# EasyEDA Pro project ProProject_STM32F407IGT6_2024-02-27.epro, board PCB2
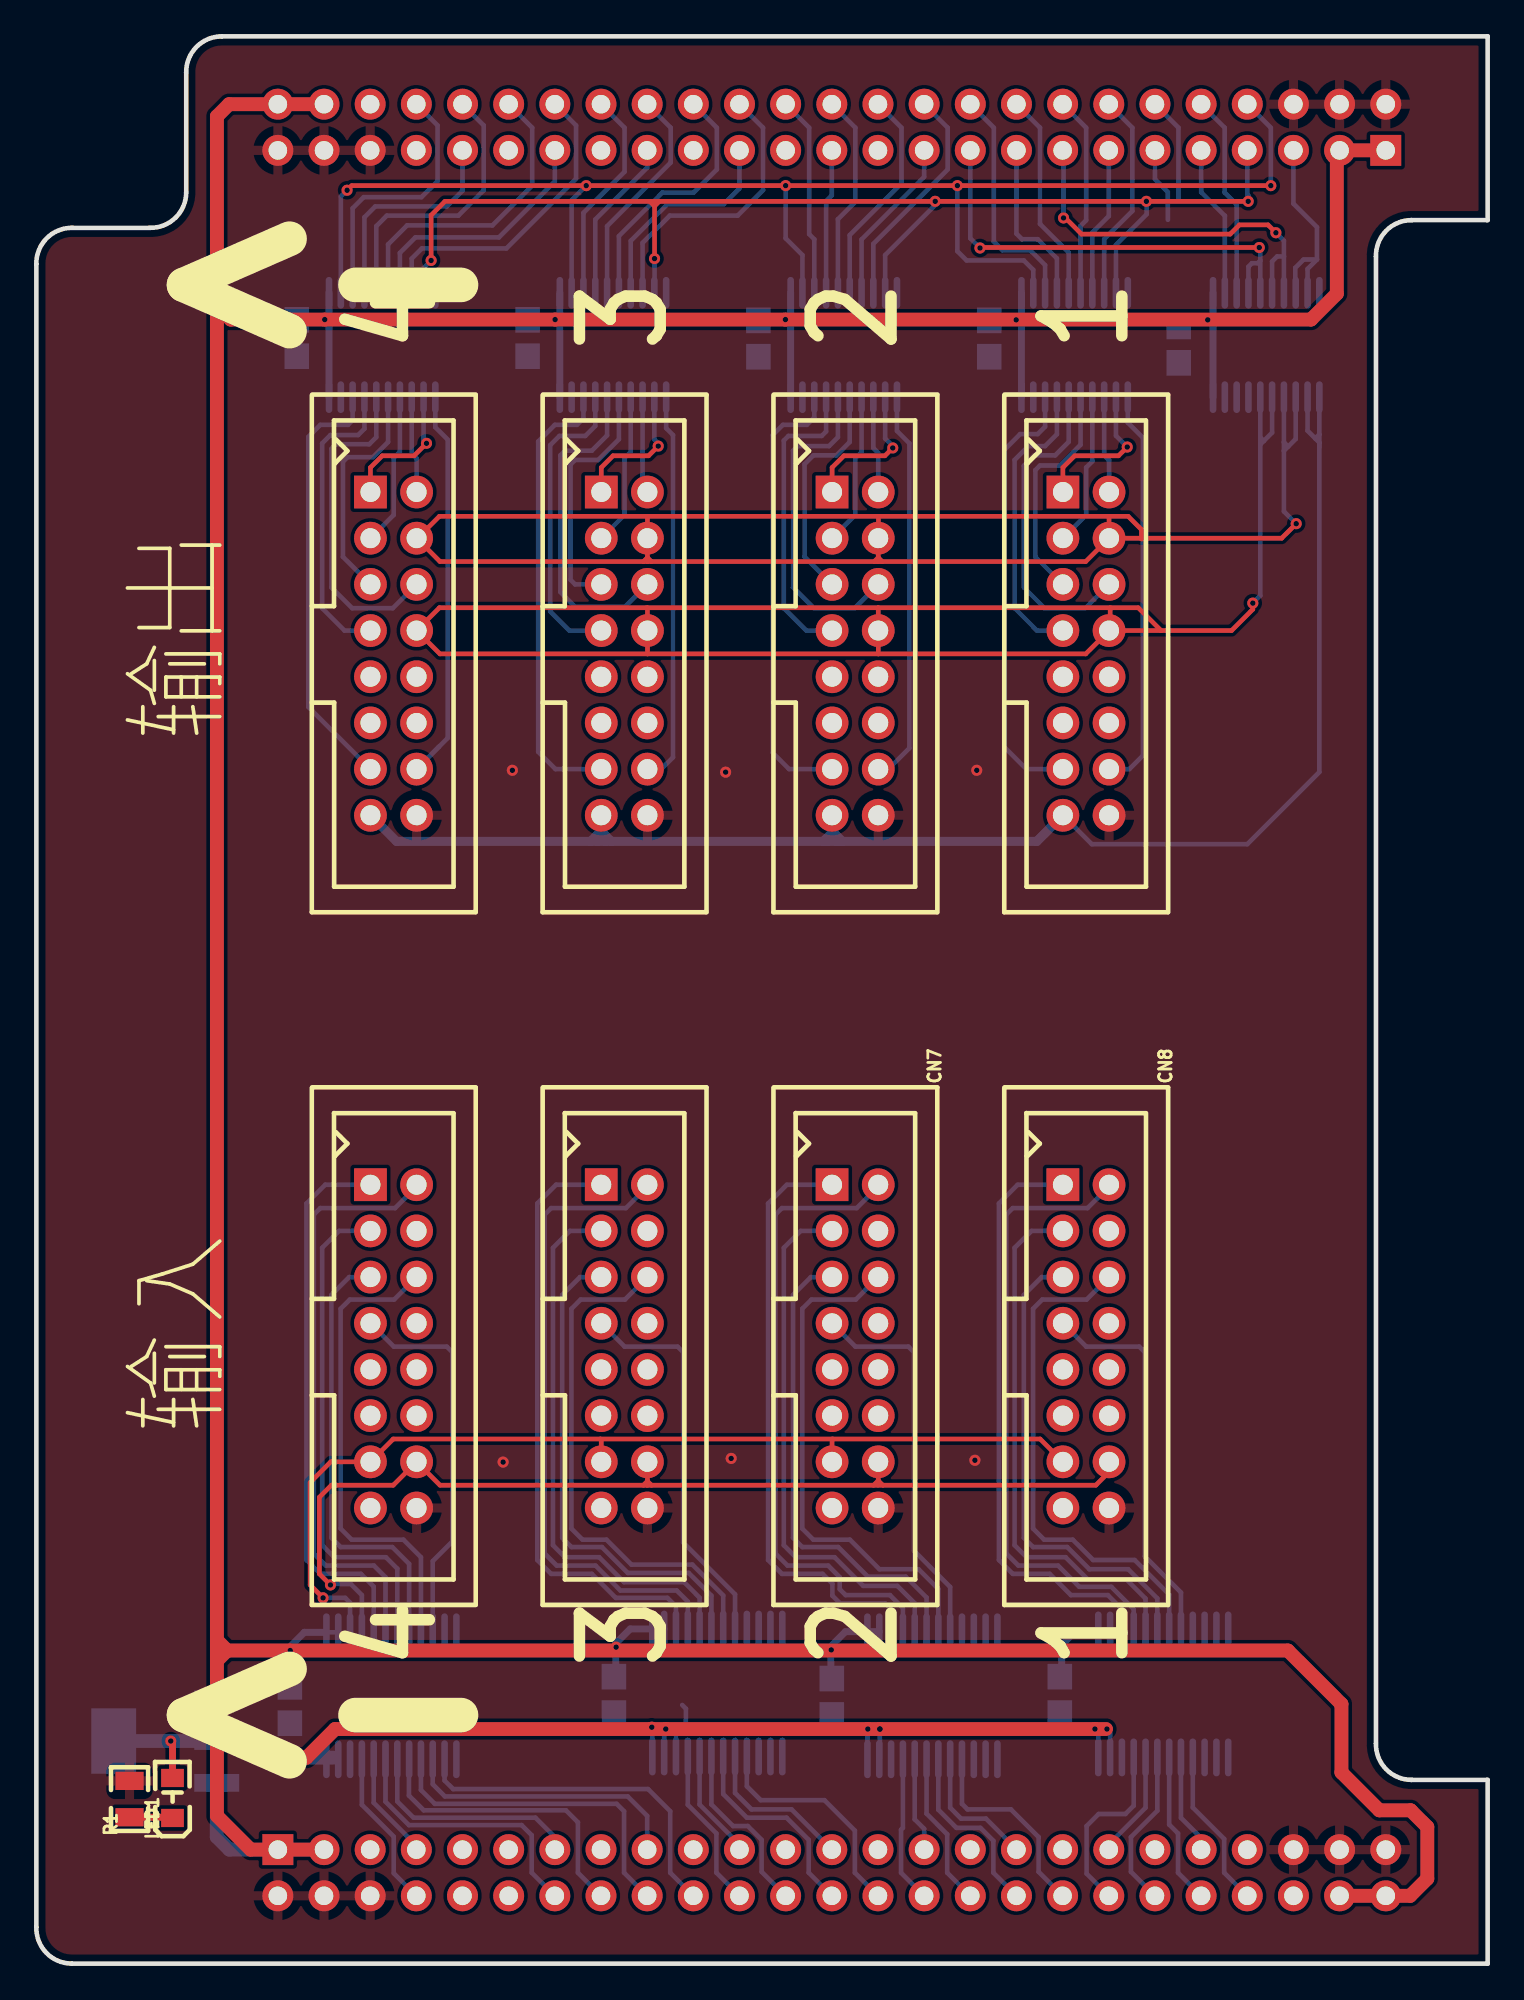
[diagram p6: board, top side]
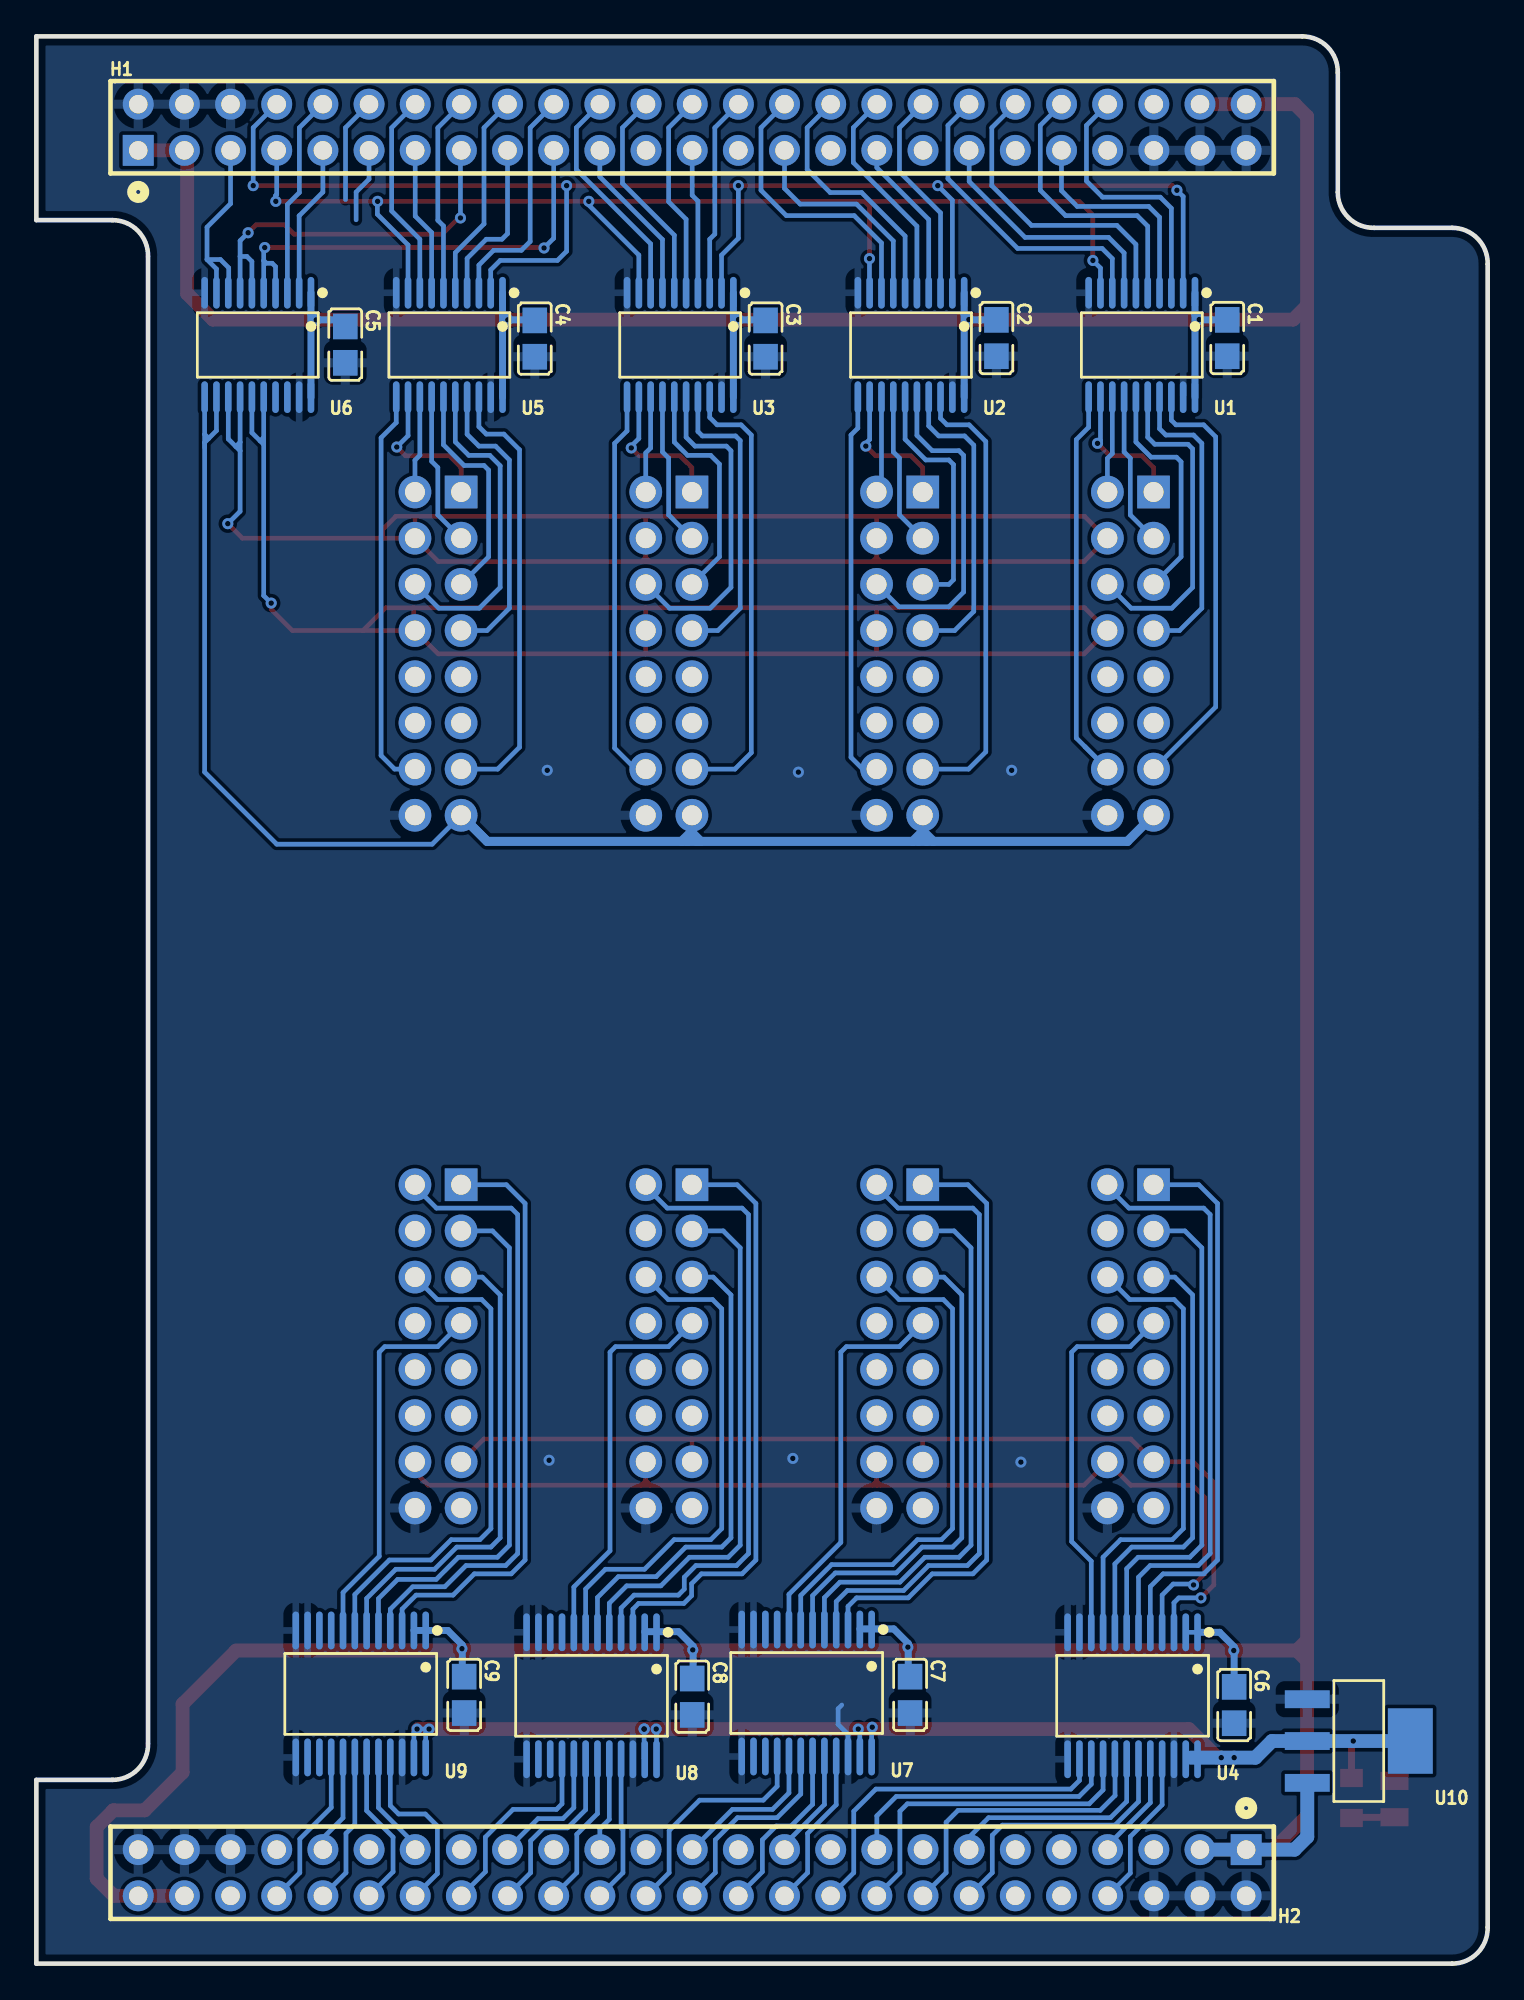
[diagram p7: board, bottom side, seen from below]

Outline 79.85 x 106 mm; copper layers: Top Layer, Bottom Layer. Coordinates in mm from the lower left corner of the outline.
Outline path: 0,93.47 0,2 arc(0.56,0.59) 1.95,0 79.85,0 79.85,10.11 75.66,10.11 arc(74.26,10.7) 73.71,12.11 73.71,93.89 arc(74.27,95.3) 75.66,95.89 79.85,95.89 79.85,106 10.2,106 arc(8.8,105.41) 8.25,104 8.25,97.42 arc(7.66,96.03) 6.25,95.47 1.95,95.47 arc(0.56,94.88) 0,93.47
Stack: Top Layer 0.035mm / Dielectric1 1.51mm FR4 er 4.5 / Bottom Layer 0.035mm

## Design rules (mm)
template: JLCPCB Capability(Two Layers Board)
spacing copperThickness1oz (default): track to track 0.102, other pairs 0.152 to 0.3
spacing copperThickness2oz: track to track 0.203, other pairs 0.152 to 0.3
track width copperThickness1oz (default): min 0.127, default 0.254, max 2.54
track width copperThickness2oz: min 0.203, default 0.254, max 2.54
differential pair differentialPair (default): width min 0.127, default 0.254, max 2.54; gap min 0.152, default 0.152
via viaSize (default): diameter min 0.5, default 0.61, max 10; hole min 0.3, default 0.305, max 6.3

## Placement (name value [footprint] x y rotation side)
C1  100nF  [C0805]  14.33 89.41 270 bottom
C2  100nF  [C0805]  27.03 89.41 270 bottom
C3  100nF  [C0805]  39.73 89.38 270 bottom
C4  100nF  [C0805]  52.43 89.38 270 bottom
C5  100nF  [C0805]  62.86 89.05 270 bottom
C6  100nF  [C0805]  13.95 14.22 270 bottom
C7  100nF  [C0805]  31.78 14.78 270 bottom
C8  100nF  [C0805]  43.77 14.68 270 bottom
C9  100nF  [C0805]  56.32 14.78 270 bottom
CN1  BH254V-16P  [IDC-TH_16P-P2.54-V-R2-C8-S2.54]  57.75 72.05 270 top
CN2  BH254V-16P  [IDC-TH_16P-P2.54-V-R2-C8-S2.54]  45.05 72.05 270 top
CN3  BH254V-16P  [IDC-TH_16P-P2.54-V-R2-C8-S2.54]  32.35 72.05 270 top
CN4  BH254V-16P  [IDC-TH_16P-P2.54-V-R2-C8-S2.54]  19.65 72.05 270 top
CN5  BH254V-16P  [IDC-TH_16P-P2.54-V-R2-C8-S2.54]  19.65 33.95 270 top
CN6  BH254V-16P  [IDC-TH_16P-P2.54-V-R2-C8-S2.54]  32.35 33.95 270 top
CN7  BH254V-16P  [IDC-TH_16P-P2.54-V-R2-C8-S2.54]  45.05 33.95 270 top
CN8  BH254V-16P  [IDC-TH_16P-P2.54-V-R2-C8-S2.54]  57.75 33.95 270 top
H1  FH-00077  [HDR-TH_50P-P2.54-V-F-R2-C25-S2.54-1]  43.77 101 180 bottom
H2  FH-00077  [HDR-TH_50P-P2.54-V-F-R2-C25-S2.54-1]  43.77 5 0 bottom
LED1  -  [LED0805-RD_RED]  7.49 9.11 90 top
R1  1K  [R0805]  5.13 9.05 90 top
U1  SN74HC245PW  [TSSOP-20_L6.5-W4.4-P0.65-LS6.4-BL]  19.03 89.03 0 bottom
U2  SN74HC245PW  [TSSOP-20_L6.5-W4.4-P0.65-LS6.4-BL]  31.73 89.03 0 bottom
U3  SN74HC245PW  [TSSOP-20_L6.5-W4.4-P0.65-LS6.4-BL]  44.43 89.03 0 bottom
U4  SN74LVC4245ADBR  [SSOP-24_L8.4-W5.8-P0.65-LS7.8-BL]  19.54 14.73 0 bottom
U5  SN74HC245PW  [TSSOP-20_L6.5-W4.4-P0.65-LS6.4-BL]  57.13 89.03 0 bottom
U6  SN74HC245PW  [TSSOP-20_L6.5-W4.4-P0.65-LS6.4-BL]  67.67 89.03 0 bottom
U7  SN74LVC4245ADBR  [SSOP-24_L8.4-W5.8-P0.65-LS7.8-BL]  37.47 14.88 0 bottom
U8  SN74LVC4245ADBR  [SSOP-24_L8.4-W5.8-P0.65-LS7.8-BL]  49.31 14.73 0 bottom
U9  SN74LVC4245ADBR  [SSOP-24_L8.4-W5.8-P0.65-LS7.8-BL]  62.01 14.83 0 bottom
U10  AMS1117-3.3  [SOT-223-4_L6.5-W3.5-P2.30-LS7.0-BR]  7.09 12.24 0 bottom

## Footprints (pads in the part's own frame, mm; a bottom-side part is the same pattern mirrored in y, then rotated)
C0805
  rect 1.41x1.35 smd: 1(-1,0) 2(1,0)
HDR-TH_50P-P2.54-V-F-R2-C25-S2.54-1
  rect 1.7x1.7 hole 1.02: 1(-30.48,-1.27)
  round 1.7 hole 1.02: 2(-30.48,1.27) 3(-27.94,-1.27) 4(-27.94,1.27) 5(-25.4,-1.27) 6(-25.4,1.27) 7(-22.86,-1.27) 8(-22.86,1.27) 9(-20.32,-1.27) 10(-20.32,1.27) 11(-17.78,-1.27) 12(-17.78,1.27) 13(-15.24,-1.27) 14(-15.24,1.27) 15(-12.7,-1.27) 16(-12.7,1.27) 17(-10.16,-1.27) 18(-10.16,1.27) 19(-7.62,-1.27) 20(-7.62,1.27) 21(-5.08,-1.27) 22(-5.08,1.27) 23(-2.54,-1.27) 24(-2.54,1.27) 25(0,-1.27) 26(0,1.27) 27(2.54,-1.27) 28(2.54,1.27) 29(5.08,-1.27) 30(5.08,1.27) 31(7.62,-1.27) 32(7.62,1.27) 33(10.16,-1.27) 34(10.16,1.27) 35(12.7,-1.27) 36(12.7,1.27) 37(15.24,-1.27) 38(15.24,1.27) 39(17.78,-1.27) 40(17.78,1.27) 41(20.32,-1.27) 42(20.32,1.27) 43(22.86,-1.27) 44(22.86,1.27) 45(25.4,-1.27) 46(25.4,1.27) 47(27.94,-1.27) 48(27.94,1.27) 49(30.48,-1.27) 50(30.48,1.27)
IDC-TH_16P-P2.54-V-R2-C8-S2.54
  rect 1.8x1.8 hole 1.1: 1(-8.89,-1.27)
  round 1.8 hole 1.1: 2(-8.89,1.27) 3(-6.35,-1.27) 4(-6.35,1.27) 5(-3.81,-1.27) 6(-3.81,1.27) 7(-1.27,-1.27) 8(-1.27,1.27) 9(1.27,-1.27) 10(1.27,1.27) 11(3.81,-1.27) 12(3.81,1.27) 13(6.35,-1.27) 14(6.35,1.27) 15(8.89,-1.27) 16(8.89,1.27)
LED0805-RD_RED
  rect 1x1.25 smd: 1(-1.1,0) 2(1.1,0)
R0805
  rect 1x1.55 smd: 1(-1,0) 2(1,0)
SOT-223-4_L6.5-W3.5-P2.30-LS7.0-BR
  rect 2.47x0.98 smd: 1(2.835,-2.3) 2(2.835,0) 3(2.835,2.3)
  rect 2.47x3.6 smd: 4(-2.835,0)
SSOP-24_L8.4-W5.8-P0.65-LS7.8-BL
  oval 0.364x2.082 smd: 1(-3.575,-3.491) 2(-2.925,-3.491) 3(-2.275,-3.491) 4(-1.625,-3.491) 5(-0.975,-3.491) 6(-0.325,-3.491) 7(0.325,-3.491) 8(0.975,-3.491) 9(1.625,-3.491) 10(2.275,-3.491) 11(2.925,-3.491) 12(3.575,-3.491) 13(3.575,3.491) 14(2.925,3.491) 15(2.275,3.491) 16(1.625,3.491) 17(0.975,3.491) 18(0.325,3.491) 19(-0.325,3.491) 20(-0.975,3.491) 21(-1.625,3.491) 22(-2.275,3.491) 23(-2.925,3.491) 24(-3.575,3.491)
TSSOP-20_L6.5-W4.4-P0.65-LS6.4-BL
  oval 0.364x1.742 smd: 1(-2.925,-2.871) 2(-2.275,-2.871) 3(-1.625,-2.871) 4(-0.975,-2.871) 5(-0.325,-2.871) 6(0.325,-2.871) 7(0.975,-2.871) 8(1.625,-2.871) 9(2.275,-2.871) 10(2.925,-2.871) 11(2.925,2.871) 12(2.275,2.871) 13(1.625,2.871) 14(0.975,2.871) 15(0.325,2.871) 16(-0.325,2.871) 17(-0.975,2.871) 18(-1.625,2.871) 19(-2.275,2.871) 20(-2.925,2.871)

## Nets
As in the schematic.

Pads without a net: CN1 9 10 11 12; CN2 9 10 11 12; CN3 9 10 11 12; CN4 9 10 11 12; CN5 4 8 9 10 11 12; CN6 4 8 9 10 11 12; CN7 4 8 9 10 11 12; CN8 4 8 9 10 11 12; H1 9 10 11 12; H2 9 10 11 12; U6 2 3 17 18

## Via types
v1: diameter 0.61, hole 0.305, Top Layer to Bottom Layer, 47 vias

## Routing (per net, layer and track width the routed paths; a pad name or vN(x,y) marks a point on that pad's centre or on a via; arc(x,y) is an arc through that point)
+3.3V: length 70.7
  Top Layer w0.254: 33.85,12.9 33.85,13 v1(33.86,13) ; v1(14.66,11.33) 14.66,11.38
  Top Layer w0.381: v1(7.4,12.24) 7.49,12.15 LED1.2
  Top Layer w0.762: v1(13.95,11.33) v1(14.66,11.33) 14.86,11.33 16.44,12.9 v1(34.63,12.9) v1(45.75,12.9) v1(46.41,12.9) v1(58.25,12.9) 58.86,12.9
  Bottom Layer w0.254: U7.24 33.89,12.97 v1(33.86,13) ; U9.23 59.08,12.73 v1(58.91,12.9) v1(58.25,12.9) 58.43,12.72 U9.24 ; v1(45.75,12.9) 45.73,12.88 U8.24 ; U7.23 34.54,12.82 v1(34.63,12.9) ; U8.23 46.41,11.27 v1(46.41,12.9)
  Bottom Layer w0.762: U10.4 v1(7.4,12.24) 11.87,12.24 12.78,11.33 v1(13.95,11.33) v1(14.66,11.33) 16.34,11.33
+5V: length 329.6
  Top Layer w0.762: H1.1 71.82,99.73 71.56,99.47 ; 9.94,17.79 9.94,16.66 ; 9.94,17.79 9.94,91.19 ; 9.94,17.79 10.5,17.22 ; 9.94,16.66 10.5,17.22 ; 9.94,16.66 9.94,8.13 11.79,6.27 H2.1 H2.3 ; 9.94,91.19 9.94,101.6 10.61,102.27 H1.50 H1.48 ; 9.94,91.19 10.7,90.42 v1(15.87,90.42) v1(28.54,90.42) v1(41.22,90.42) 70.13,90.42 71.56,91.85 71.56,99.47 ; 71.56,99.47 71.56,99.58 H1.3 ; 10.5,17.22 v1(13.97,17.22) 68.86,17.22 71.81,14.28 71.81,10.52 73.89,8.43 75.62,8.43 76.53,7.52 76.53,4.67 75.59,3.73 H2.50 H2.48
  Bottom Layer w0.254: 15.96,18.22 U4.2
  Bottom Layer w0.381: 64.74,90.7 U6.1 ; 64.74,90.7 U6.20 ; 64.74,90.7 v1(64.45,90.41) 62.97,90.41 ; 43.72,15.26 43.72,17.46 44.52,18.26 46.38,18.26 ; 54.2,90.7 U5.20 ; 54.2,90.7 U5.1 ; 54.2,90.7 v1(53.91,90.41) 52.43,90.41 ; 39.73,90.41 41.21,90.41 41.5,90.7 ; 41.5,90.7 U3.20 ; 41.5,90.7 U3.1 ; 34.54,18.41 32.68,18.41 31.88,17.61 31.88,15.41 ; U9.2 U9.1 57.22,18.32 56.42,17.53 56.42,15.33 ; C1.1 15.81,90.41 16.1,90.7 ; C2.1 28.51,90.41 28.8,90.7 ; 28.8,90.7 U2.20 ; 28.8,90.7 U2.1 ; 16.1,90.7 U1.1 ; 16.1,90.7 U1.20 ; C6.1 13.95,17.42 14.75,18.22 15.96,18.22
  Bottom Layer w0.762: 9.93,9.94 9.93,6.97 10.62,6.27 H2.1 H2.3
  vias: v1(31.9,17.41) v1(43.74,17.25) v1(56.44,17.32)
GND: length 3.1
  Bottom Layer w0.254: U7.22 35.19,12.61 35.74,13.16 35.74,14.02 35.54,14.22
  vias: v1(25.68,27.58) v1(26.19,65.63) v1(37.93,65.53) v1(38.23,27.79) v1(51.64,27.69) v1(51.74,65.63)
(no net): length 29.5
  Bottom Layer w0.254: U6.3 66.04,96.75 65.38,97.41 65.38,100.97 H1.10 ; H1.11 61.55,98.15 62.26,97.43 62.26,95.91 ; 65.39,96.13 64.09,97.43 H1.9 ; 65.39,96.13 65.39,96.14 ; 65.39,96.13 U6.2 ; H1.12 62.84,100.97 62.84,97.03
BD0: length 11
  Bottom Layer w0.254: H1.16 57.76,100.97 57.76,95.89 57.45,95.58 57.45,91.9
BD1: length 13
  Bottom Layer w0.254: U5.3 55.5,93.42 54.69,94.23 53.17,94.23 52.68,94.72 52.68,100.97 H1.20
BD2: length 12.1
  Bottom Layer w0.254: H1.24 47.6,100.97 47.6,97.92 44.75,95.07 U3.6
BD3: length 11
  Bottom Layer w0.254: U3.3 42.8,94.84 42.52,95.12 42.52,100.97 H1.28
BD4: length 14.2
  Bottom Layer w0.254: 32.05,91.9 32.05,95.02 34.45,97.41 36.17,97.41 37.44,98.68 37.44,100.97 H1.32
BD5: length 11.8
  Bottom Layer w0.254: U2.3 30.1,96.29 32.36,98.55 32.36,100.97 H1.36
BD6: length 16.9
  Bottom Layer w0.254: U1.6 19.35,94.56 20.4,95.61 25.1,95.61 27.28,97.79 27.28,100.97 H1.40
BD7: length 14.7
  Bottom Layer w0.254: H1.44 22.08,101.1 22.08,98.04 21.19,97.16 18.01,97.16 17.4,96.55 U1.3
BD8: length 16.5
  Bottom Layer w0.254: H2.16 29.8,5 29.8,7.77 29.14,8.43 21.31,8.43 20.5,9.25 20.5,11.23 U4.17
BD9: length 19.5
  Bottom Layer w0.254: U4.14 22.46,10.07 22.93,9.6 33.66,9.6 34.88,8.38 34.88,5 H2.20
BD10: length 9.8
  Bottom Layer w0.254: U7.19 37.14,8.76 38.33,7.57 39.15,7.57 39.91,6.81 39.91,5.05 H2.24
BD11: length 12.7
  Bottom Layer w0.254: U7.16 39.09,9.75 39.86,8.99 43.36,8.99 45.04,7.31 45.04,5 H2.28
BD12: length 8.5
  Bottom Layer w0.254: H2.32 50.12,5 50.12,7.11 48.98,8.25 U8.19
BD13: length 11.2
  Bottom Layer w0.254: U8.16 50.93,8.79 51.24,8.48 53.62,8.48 55.15,6.96 55.15,5.05 H2.36
BD14: length 8.8
  Bottom Layer w0.254: U9.19 61.68,8.41 60.23,6.96 60.23,5.05 H2.40
BD15: length 8.9
  Bottom Layer w0.254: H2.44 65.36,5 65.36,6.86 63.63,8.59 U9.16
CKA: length 83.7
  Top Layer w0.254: v1(67.92,97.79) v1(50.68,97.79) v1(41.23,97.79) v1(30.26,97.79) 17.35,97.79 v1(17.1,97.54)
  Bottom Layer w0.254: v1(41.23,97.79) 41.23,94.89 42.15,93.97 U3.2 ; v1(17.1,97.54) 16.75,97.19 U1.2 ; 29.45,91.9 29.45,96.99 v1(30.26,97.79) ; H1.8 67.92,100.97 v1(67.92,97.79) ; U5.2 54.85,93.16 54.33,93.67 51.18,93.67 50.68,94.18 v1(50.68,97.79)
CKA_IN: length 8.8
  Bottom Layer w0.254: U4.21 17.91,8.74 19.66,6.99 19.66,4.97 H2.8
CLK: length 55.3
  Top Layer w0.254: CN8.13 55.23,28.85 43.8,28.85 ; 43.8,28.85 31.03,28.85 ; 43.8,28.85 43.78,28.83 CN7.13 ; 31.03,28.85 19.64,28.85 CN5.13 16.2,27.6 15.07,26.47 15.07,20.83 v1(15.78,20.12) ; 31.03,28.85 31.08,28.8 CN6.13
  Bottom Layer w0.254: v1(15.78,20.12) 17,20.12 17.26,19.85 17.26,18.22
CLK1: length 24.5
  Bottom Layer w0.254: CN1.13 54.47,65.7 53.27,66.9 53.27,83.26 54.13,84.12 55.1,84.12 55.5,84.53 U5.18
CLK2: length 24.9
  Bottom Layer w0.254: CN2.13 41.42,65.7 40.52,66.6 40.52,84.07 41.08,84.63 42.4,84.63 42.8,85.04 U3.18
CLK3: length 25.1
  Bottom Layer w0.254: U2.18 30.1,84.99 29.75,84.63 28.53,84.63 27.61,83.72 27.61,66.65 28.56,65.7 CN3.13
CLK4: length 23.8
  Bottom Layer w0.254: U1.18 17.4,84.89 17.15,84.63 15.62,84.63 14.96,83.97 14.96,69.12 CN4.13
GD0: length 8.2
  Bottom Layer w0.254: H1.13 59.01,96.11 58.1,95.21 U5.7
GD1: length 9.3
  Bottom Layer w0.254: H1.17 53.93,95.15 54.23,94.84 55.1,94.84 56.15,93.79 U5.4
GD2: length 9.3
  Bottom Layer w0.254: U3.7 45.4,94.83 48.85,98.27 H1.21
GD3: length 8
  Bottom Layer w0.254: H1.25 43.77,97.26 43.45,96.94 U3.4
GD4: length 12.1
  Bottom Layer w0.254: U2.7 32.7,94.75 34.73,96.77 37.82,96.77 38.69,97.64 H1.29
GD5: length 9
  Bottom Layer w0.254: U2.4 30.75,95.93 33.61,98.78 H1.33
GD6: length 14.1
  Bottom Layer w0.254: U1.7 20,94.09 20.86,94.94 25.45,94.94 28.53,98.02 H1.37
GD7: length 12.4
  Bottom Layer w0.254: U1.4 18.05,96.05 18.65,96.65 22.58,96.65 23.45,97.51 H1.41
GD8: length 12.5
  Bottom Layer w0.254: H2.13 28.53,6.96 27.46,8.03 20.76,8.03 19.86,8.92 U4.18
GD9: length 15.7
  Bottom Layer w0.254: H2.17 33.61,8.13 32.54,9.19 22.48,9.19 21.81,9.87 U4.15
GD10: length 6
  Bottom Layer w0.254: H2.21 38.69,6.55 36.49,8.75 U7.20
GD11: length 8.6
  Bottom Layer w0.254: H2.25 41.55,8.48 39.35,8.48 38.44,9.39 U7.17
GD12: length 5.2
  Bottom Layer w0.254: H2.29 48.85,7.42 48.33,7.93 U8.20
GD13: length 7.3
  Bottom Layer w0.254: H2.33 53.93,6.3 52.25,7.98 50.88,7.98 50.28,8.58 U8.17
GD14: length 5.9
  Bottom Layer w0.254: U9.20 61.03,8.58 59.01,6.55 H2.37
GD15: length 5.5
  Bottom Layer w0.254: H2.41 64.09,6.91 62.98,8.02 U9.17
HUB1_B1: length 8.4
  Bottom Layer w0.254: CN1.3 57.76,79.68 57.76,82.29 58.1,82.63 U5.14
HUB1_B2: length 16.3
  Bottom Layer w0.254: CN1.7 55.06,73.32 53.83,74.55 53.83,82.7 54.59,83.46 55.5,83.46 56.15,84.11 U5.17
HUB1_G1: length 5.3
  Bottom Layer w0.254: CN1.2 59.02,82.69 58.75,82.96 U5.13
HUB1_G2: length 17.9
  Bottom Layer w0.254: U5.16 56.8,83.7 56.06,82.96 54.91,82.96 54.33,82.38 54.33,75.69 55.48,74.55 57.71,74.55 CN1.6
HUB1_R1: length 8.4
  Top Layer w0.254: v1(60.02,83.41) 59.54,82.93 57.13,82.93 56.48,82.29 CN1.1
  Bottom Layer w0.254: U5.12 59.4,84.03 v1(60.02,83.41)
HUB1_R2: length 12.6
  Bottom Layer w0.254: CN1.5 54.97,77.37 54.97,82.14 55.22,82.4 56.32,82.4 57.45,83.54 57.45,86.16
HUB2_B1: length 8.4
  Bottom Layer w0.254: U3.14 45.4,83.14 45.06,82.8 45.06,79.68 CN2.3
HUB2_B2: length 16.8
  Bottom Layer w0.254: U3.17 43.45,84.27 43.21,84.02 41.38,84.02 41.13,83.77 41.13,74.55 42.36,73.32 CN2.7
HUB2_G1: length 5.3
  Bottom Layer w0.254: U3.13 46.05,83.36 46.32,83.09 46.32,80.94
HUB2_G2: length 18.2
  Bottom Layer w0.254: 46.32,75.86 45.01,74.55 42.78,74.55 41.63,75.69 41.63,83.21 41.89,83.46 43.62,83.46 44.1,83.95 44.1,86.16
HUB2_R1: length 8.1
  Top Layer w0.254: CN2.1 43.78,82.29 44.43,82.93 46.69,82.93 v1(47.12,83.36)
  Bottom Layer w0.254: v1(47.12,83.36) 47.12,83.46 46.7,83.88 U3.12
HUB2_R2: length 12.7
  Bottom Layer w0.254: U3.15 44.75,83.69 44.02,82.96 42.75,82.96 42.27,82.47 42.27,77.37 CN2.5
HUB3_B1: length 8.4
  Bottom Layer w0.254: U2.14 32.7,83.14 32.36,82.8 32.36,79.68 CN3.3
HUB3_B2: length 16.9
  Bottom Layer w0.254: U2.17 30.75,84.57 30.2,84.02 28.78,84.02 28.27,83.52 28.27,74.37 29.33,73.32 CN3.7
HUB3_G1: length 5.3
  Bottom Layer w0.254: CN3.2 33.35,81.21 U2.13
HUB3_G2: length 18.3
  Bottom Layer w0.254: CN3.6 32.39,74.62 29.65,74.62 28.83,75.44 28.83,82.96 29.09,83.21 30.56,83.21 31.4,84.05 U2.16
HUB3_R1: length 7.7
  Top Layer w0.254: CN3.1 31.08,82.29 31.73,82.93 33.68,82.93 v1(34.22,83.46)
  Bottom Layer w0.254: U2.12 34,83.83 34.22,83.62 v1(34.22,83.46)
HUB3_R2: length 13.7
  Bottom Layer w0.254: CN3.5 29.65,75.86 29.39,76.11 29.39,82.45 29.65,82.7 30.92,82.7 32.05,83.84 32.05,86.16
HUB4_B1: length 8.4
  Bottom Layer w0.254: U1.14 20,83.14 19.66,82.8 19.66,79.68 CN4.3
HUB4_B2: length 16.6
  Bottom Layer w0.254: CN4.7 16.96,73.32 15.73,74.55 15.73,83.62 16.18,84.07 17.71,84.07 18.05,84.42 U1.17
HUB4_G1: length 5.3
  Bottom Layer w0.254: CN4.2 20.92,82.79 20.65,83.06 U1.13
HUB4_G2: length 18.3
  Bottom Layer w0.254: CN4.6 19.61,74.55 17.38,74.55 16.23,75.69 16.23,83.31 16.49,83.57 18.32,83.57 18.7,83.95 U1.16
HUB4_R1: length 7.6
  Top Layer w0.254: CN4.1 18.38,82.29 19.03,82.93 20.78,82.93 v1(21.47,83.62)
  Bottom Layer w0.254: U1.12 21.3,83.78 v1(21.47,83.62)
HUB4_R2: length 12.8
  Bottom Layer w0.254: U1.15 19.35,83.69 18.52,82.86 17.12,82.86 16.87,82.6 16.87,77.37 CN4.5
HUB5_B1: length 27.6
  Bottom Layer w0.254: U4.7 19.86,21.72 19.23,22.35 16.39,22.35 15.73,23.01 15.73,39.37 16.66,40.3 CN5.3
HUB5_B2: length 21
  Bottom Layer w0.254: CN5.7 19.67,33.93 22.58,33.93 22.89,33.63 22.89,23.22 21.81,22.14 U4.10
HUB5_G1: length 32.5
  Bottom Layer w0.254: CN5.2 20.92,42.74 19.74,41.55 15.62,41.55 15.27,41.2 15.27,22.56 15.93,21.9 18.57,21.9 19.21,21.25 U4.6
HUB5_G2: length 26.2
  Bottom Layer w0.254: CN5.6 19.69,36.53 17.25,36.53 16.74,36.02 16.74,23.93 17.35,23.32 20.2,23.32 21.16,22.35 U4.9
HUB5_R1: length 30.4
  Bottom Layer w0.254: CN5.1 15.89,42.84 14.86,41.81 14.86,22.2 15.62,21.44 17.86,21.44 18.56,20.74 U4.5
HUB5_R2: length 24.5
  Bottom Layer w0.254: U4.8 20.51,21.99 19.59,22.91 16.74,22.91 16.23,23.42 16.23,36.78 17.22,37.76 CN5.5
HUB6_B1: length 30.4
  Bottom Layer w0.254: CN6.3 29.36,40.3 28.43,39.37 28.43,23.01 29.09,22.35 30.97,22.35 32.34,20.98 35.64,20.98 36.49,20.13 U7.5
HUB6_B2: length 21.6
  Bottom Layer w0.254: CN6.7 32.37,33.93 35.28,33.93 35.59,33.63 35.59,23.16 38.44,20.31 U7.8
HUB6_G1: length 35.5
  Bottom Layer w0.254: U7.4 35.84,19.91 35.23,20.52 32.14,20.52 30.76,21.9 28.63,21.9 27.97,22.56 27.97,41.2 28.33,41.55 32.44,41.55 33.62,42.74 CN6.2
HUB6_G2: length 28.7
  Bottom Layer w0.254: U7.7 37.79,20.25 36.1,21.95 32.74,21.95 31.37,23.32 30.05,23.32 29.44,23.93 29.44,36.02 29.95,36.53 32.39,36.53 CN6.6
HUB6_R1: length 33.5
  Bottom Layer w0.254: CN6.1 28.59,42.84 27.56,41.81 27.56,22.2 28.33,21.44 30.56,21.44 31.88,20.12 34.73,20.12 35.19,19.65 U7.3
HUB6_R2: length 27.3
  Bottom Layer w0.254: CN6.5 29.92,37.76 28.93,36.78 28.93,23.42 29.44,22.91 31.12,22.91 32.54,21.49 35.89,21.49 37.14,20.24 U7.6
HUB7_B1: length 29.5
  Bottom Layer w0.254: CN7.3 42.06,40.3 41.13,39.37 41.13,23.01 41.79,22.35 43.92,22.35 45.5,20.78 47.37,20.78 48.33,19.82 U8.5
HUB7_B2: length 21.4
  Bottom Layer w0.254: CN7.7 45.07,33.93 47.98,33.93 48.29,33.63 48.29,22.71 50.28,20.72 U8.8
HUB7_G1: length 35
  Bottom Layer w0.254: U8.4 47.68,19.56 46.97,20.27 44.53,20.27 44.2,20.59 44.2,21.25 43.56,21.9 41.33,21.9 40.67,22.56 40.67,41.2 41.02,41.55 45.14,41.55 46.32,42.74 CN7.2
HUB7_G2: length 28.2
  Bottom Layer w0.254: CN7.6 45.09,36.53 42.65,36.53 42.14,36.02 42.14,23.93 42.75,23.32 44.76,23.32 46.39,21.69 48.54,21.69 49.63,20.6 U8.7
HUB7_R1: length 33.1
  Bottom Layer w0.254: CN7.1 41.29,42.84 40.26,41.81 40.26,22.2 41.02,21.44 43.26,21.44 43.8,20.9 43.8,20.24 44.23,19.81 46.71,19.81 47.03,19.5 U8.3
HUB7_R2: length 26.5
  Bottom Layer w0.254: U8.6 48.98,20.14 47.83,21.28 45.75,21.28 44.12,22.91 42.14,22.91 41.63,23.42 41.63,36.78 42.62,37.76 CN7.5
HUB8_B1: length 29.6
  Bottom Layer w0.254: CN8.3 54.76,40.3 53.83,39.37 53.83,23.01 54.49,22.35 56.63,22.35 57.85,21.13 59.97,21.13 61.03,20.08 U9.5
HUB8_B2: length 21.3
  Bottom Layer w0.254: CN8.7 57.77,33.93 60.68,33.93 60.99,33.63 60.99,22.4 62.98,20.41 U9.8
HUB8_G1: length 34.5
  Bottom Layer w0.254: U9.4 60.38,19.49 59.15,20.73 57.38,20.73 56.21,21.9 54.03,21.9 53.37,22.56 53.37,41.2 53.73,41.55 57.84,41.55 59.02,42.74 CN8.2
HUB8_G2: length 28
  Bottom Layer w0.254: CN8.6 57.79,36.53 55.35,36.53 54.84,36.02 54.84,23.93 55.45,23.32 57.03,23.32 58.14,22.2 60.43,22.2 62.33,20.3 U9.7
HUB8_R1: length 32.6
  Bottom Layer w0.254: CN8.1 53.99,42.84 52.96,41.81 52.96,22.2 53.73,21.44 55.76,21.44 56.93,20.27 58.96,20.27 59.73,19.5 U9.3
HUB8_R2: length 26.4
  Bottom Layer w0.254: U9.6 61.68,20.09 60.08,21.69 57.94,21.69 56.72,22.91 54.84,22.91 54.33,23.42 54.33,36.78 55.32,37.76 CN8.5
LAT: length 58.7
  Top Layer w0.254: 33.84,26.31 46.07,26.31 ; 33.84,26.31 33.62,26.54 ; 33.84,26.31 33.62,26.31 ; 46.07,26.31 46.57,26.31 ; 46.07,26.31 46.32,26.57 ; 33.62,26.54 CN6.14 ; 33.62,26.54 33.62,26.32 33.62,26.31 ; 33.62,26.54 33.4,26.31 ; CN8.14 59.02,27.04 58.3,26.31 46.57,26.31 ; 46.57,26.31 46.32,26.57 ; 33.4,26.31 22.21,26.31 CN5.14 19.64,26.31 16.23,26.31 15.57,25.65 15.57,21.44 v1(16.18,20.83) ; 33.4,26.31 33.62,26.31 ; 46.32,26.57 CN7.14 ; 46.32,26.57 46.32,26.32
  Bottom Layer w0.254: v1(16.18,20.83) 16.23,20.88 17.3,20.88 17.91,20.27 U4.4
LAT1: length 22.2
  Bottom Layer w0.254: U5.11 60.05,84.76 60.89,83.92 60.89,66.45 60.14,65.7 CN1.14
LAT2: length 21.8
  Bottom Layer w0.254: U3.11 47.35,84.3 48.04,83.62 48.04,66.85 46.88,65.7 46.32,65.7
LAT3: length 21.6
  Bottom Layer w0.254: CN3.14 34.39,65.7 35.03,66.34 35.03,84.07 34.65,84.45 U2.11
LAT4: length 23.2
  Bottom Layer w0.254: 20.92,65.7 22.15,66.93 ; 22.15,66.93 CN4.14 ; 22.15,66.93 22.64,67.41 22.64,83.82 21.95,84.5 U1.11
OE_PWM_B: length 25.7
  Top Layer w0.254: v1(67.29,94.39) 51.95,94.39 v1(51.92,94.36)
  Bottom Layer w0.254: H1.19 51.39,94.89 v1(51.92,94.36) ; U6.5 67.34,93.67 ; 67.34,93.67 67.34,94.33 v1(67.29,94.39) ; 67.34,93.67 67.2,93.52 66.88,93.52 66.69,93.33 U6.4
OE_PWM_B_O: length 110.9
  Top Layer w0.254: v1(66.93,74.83) 66.93,74.49 65.76,73.32 61.88,73.32 ; 46.32,74.57 33.6,74.57 ; 46.32,74.57 46.32,74.57 46.32,73.32 46.33,73.31 46.33,72.03 ; 46.32,74.57 59.09,74.57 ; 33.6,74.57 33.62,74.55 CN3.8 33.63,73.32 33.63,72.03 ; 33.6,74.57 22.18,74.57 CN4.8 22.21,72.03 33.63,72.03 ; 59.09,74.57 60.63,74.57 61.88,73.32 ; 59.09,74.57 59.09,73.38 CN1.8 ; 61.88,73.32 CN1.8 ; CN1.8 57.74,72.03 46.33,72.03 ; 46.33,72.03 33.63,72.03
  Bottom Layer w0.254: 67.54,83.75 67.34,83.55 ; 67.54,83.75 67.34,83.94 ; 67.54,83.75 67.99,84.2 U6.15 ; 67.34,83.55 67.34,83.94 ; 67.34,83.55 67.34,75.24 v1(66.93,74.83) ; 67.34,83.94 U6.16
OE_PWM_G: length 22.2
  Top Layer w0.254: v1(56.52,96.01) 56.62,96.01 57.51,95.12 65.69,95.12 66.2,95.63 67.77,95.63 v1(68.2,95.2)
  Bottom Layer w0.254: H1.15 56.52,99.68 v1(56.52,96.01) ; v1(68.2,95.2) 68.64,94.76 68.64,93.9 ; 68.64,93.9 68.27,93.9 67.99,93.62 U6.6 ; 68.64,93.9 U6.7
OE_PWM_G_O: length 109.2
  Top Layer w0.254: 46.33,79.6 33.59,79.6 ; 46.33,79.6 60.08,79.6 60.8,78.87 60.8,78.4 ; 46.33,79.6 46.33,78.41 46.32,78.4 46.32,77.33 ; 33.59,79.6 33.62,79.57 CN3.4 33.62,77.33 ; 33.59,79.6 22.18,79.6 20.95,78.37 ; 46.32,77.11 46.32,77.12 46.32,77.33 ; 46.32,77.11 46.11,77.11 ; 46.32,77.11 46.54,77.11 ; 60.8,78.4 CN1.4 ; 60.8,78.4 68.52,78.4 v1(69.32,79.2) ; 60.8,78.4 60.8,78.35 ; CN1.4 57.74,77.11 46.54,77.11 ; CN1.4 59.02,79.6 ; 33.84,77.11 46.11,77.11 ; 33.84,77.11 33.62,77.11 ; 33.84,77.11 33.62,77.33 ; 46.11,77.11 46.32,77.33 ; 33.41,77.11 22.21,77.11 20.95,78.37 ; 33.41,77.11 33.62,77.33 ; 33.41,77.11 33.62,77.11 ; 33.62,77.11 33.62,77.12 33.62,77.33 ; 46.32,77.33 46.54,77.11 ; 20.95,78.37 CN4.4 ; 20.95,78.37 20.92,78.35
  Bottom Layer w0.254: v1(69.32,79.2) 68.64,79.87 68.64,83.21 ; U6.13 69.29,83.86 68.88,83.44 ; 68.64,83.21 68.64,83.68 ; 68.64,83.21 68.88,83.44 ; 68.64,83.68 68.88,83.44 ; 68.64,83.68 U6.14
OE_PWM_R: length 11.3
  Bottom Layer w0.254: U6.9 69.94,93.21 70.46,93.73 ; 70.46,93.73 69.73,93.73 69.27,93.27 69.27,91.92 U6.8 ; 70.46,93.73 70.46,95.5 69.17,96.8 H1.5
OE_PWM_R_O: length 90.7
  Bottom Layer w0.254: 31.08,61.94 31.08,61.72 ; 31.08,61.94 30.87,61.72 ; 31.08,61.94 31.3,61.72 ; 31.08,61.94 CN3.15 ; CN1.15 58.07,61.57 66.63,61.57 70.59,65.54 70.59,83.66 ; 44.02,61.72 44.02,61.76 43.79,61.99 ; 70.59,84.11 70.59,83.66 ; 70.59,84.11 U6.11 ; 70.59,84.11 70.37,83.89 ; 70.59,83.66 70.37,83.89 ; 70.59,83.66 70.59,83.39 ; 70.37,83.89 69.94,84.31 U6.12 ; 43.79,61.99 43.53,61.72 ; 43.79,61.99 43.79,63.15 CN2.15
  Bottom Layer w0.5: 31.08,62.31 31.08,62.28 31.64,61.72 ; 31.08,62.31 30.5,61.72 ; 31.08,62.31 CN3.15 ; 30.5,61.72 19.82,61.72 CN4.15 ; 30.5,61.72 31.64,61.72 ; 43.78,62.29 44.35,61.72 ; 43.78,62.29 CN2.15 ; 43.78,62.29 43.78,62.2 43.3,61.72 ; 44.06,61.72 43.3,61.72 ; 44.06,61.72 44.02,61.76 ; 44.06,61.72 44.35,61.72 ; 44.35,61.72 55.05,61.72 CN1.15 55.05,61.72 ; 31.64,61.72 43.3,61.72
RD0: length 11.6
  Bottom Layer w0.254: U5.8 58.75,94.84 60.3,96.39 60.3,100.97 H1.14
RD1: length 11.6
  Bottom Layer w0.254: U5.5 56.8,94.1 55.22,95.68 55.22,100.97 H1.18
RD2: length 12.6
  Bottom Layer w0.254: U3.8 46.05,94.59 50.14,98.68 50.14,100.97 H1.22
RD3: length 11.3
  Bottom Layer w0.254: H1.26 45.06,100.97 45.06,96.9 44.1,95.94 44.1,91.9
RD4: length 15.8
  Bottom Layer w0.254: U2.8 33.35,94.64 34.85,96.14 38.59,96.14 39.98,97.54 39.98,100.97 H1.30
RD5: length 12.4
  Bottom Layer w0.254: U2.5 31.4,95.56 34.9,99.06 34.9,100.97 H1.34
RD6: length 17.3
  Bottom Layer w0.254: U1.8 20.65,93.78 21.21,94.34 25.86,94.34 29.7,98.17 29.7,101.1 H1.38
RD7: length 15.6
  Bottom Layer w0.254: H1.42 24.62,101.1 24.62,97.54 23.22,96.14 19.28,96.14 18.7,95.56 U1.5
RD8: length 15
  Bottom Layer w0.254: U4.19 19.21,8.91 20.5,7.62 26.7,7.62 27.26,7.06 27.26,5 H2.14
RD9: length 18.5
  Bottom Layer w0.254: U4.16 21.16,9.55 21.92,8.79 31.93,8.79 32.34,8.38 32.34,5 H2.18
RD10: length 8.8
  Bottom Layer w0.254: U7.21 35.84,8.74 37.42,7.16 37.42,5 H2.22
RD11: length 11.4
  Bottom Layer w0.254: U7.18 37.79,9.33 39.09,8.03 41.28,8.03 42.5,6.81 42.5,5 H2.26
RD12: length 8.1
  Bottom Layer w0.254: U8.21 47.68,7.47 47.58,7.37 47.58,5 H2.30
RD13: length 10.1
  Bottom Layer w0.254: H2.34 52.66,5 52.66,6.76 51.95,7.47 50.63,7.47 49.63,8.46 U8.18
RD14: length 10.1
  Bottom Layer w0.254: H2.38 57.79,4.95 57.79,7.57 58.45,8.23 59.92,8.23 60.38,8.69 U9.21
RD15: length 8.3
  Bottom Layer w0.254: U9.18 62.33,7.65 62.82,7.16 62.82,5 H2.42
STB: length 70
  Top Layer w0.254: 33.75,96.93 22.48,96.93 21.72,96.16 v1(21.72,93.67) ; 33.75,96.93 34.28,96.93 ; 33.75,96.93 34.01,96.66 ; v1(66.68,96.93) v1(61.08,96.93) v1(49.46,96.93) 34.28,96.93 ; 34.28,96.93 34.01,96.66 ; 34.01,96.66 v1(34.01,93.78)
  Bottom Layer w0.254: U1.9 21.3,93.26 v1(21.72,93.67) ; H1.7 66.63,97.31 66.69,97.24 66.69,96.92 66.69,96.93 v1(66.68,96.93) ; v1(49.46,96.93) 49.46,96.72 46.7,93.97 U3.9 ; 61.09,96.93 61.09,96.22 59.4,94.53 U5.9 ; U2.9 34.01,91.91 v1(34.01,93.78)
STB_IN: length 5.9
  Bottom Layer w0.254: U4.20 18.56,8.85 20.91,6.5 H2.7
$1N9953: length 2.4
  Top Layer w0.381: R1.1 7.45,8.05 LED1.1

## Copper pours and planes (outline as drawn; the poured copper is in the pictures)
GND on Top Layer: 0.38,110.19 82.43,110.19 87.86,104.75 87.86,-0.91 84.2,-4.57 -9.52,-4.57 -13.43,-0.66 -13.43,96.37
GND on Bottom Layer: 0.74,112.17 85.88,112.17 91.88,106.17 91.88,-12.55 88.62,-15.8 -0.58,-15.8 -26.08,9.7 -9.62,26.16 -9.62,112.37 0.54,112.37

## Text on the board
Top Silkscreen Layer: 4 | 3 | 2 | 1 | <- | 输出 | 输入
